# EAGLE design DACBRDV32 (EAGLE 5.07)
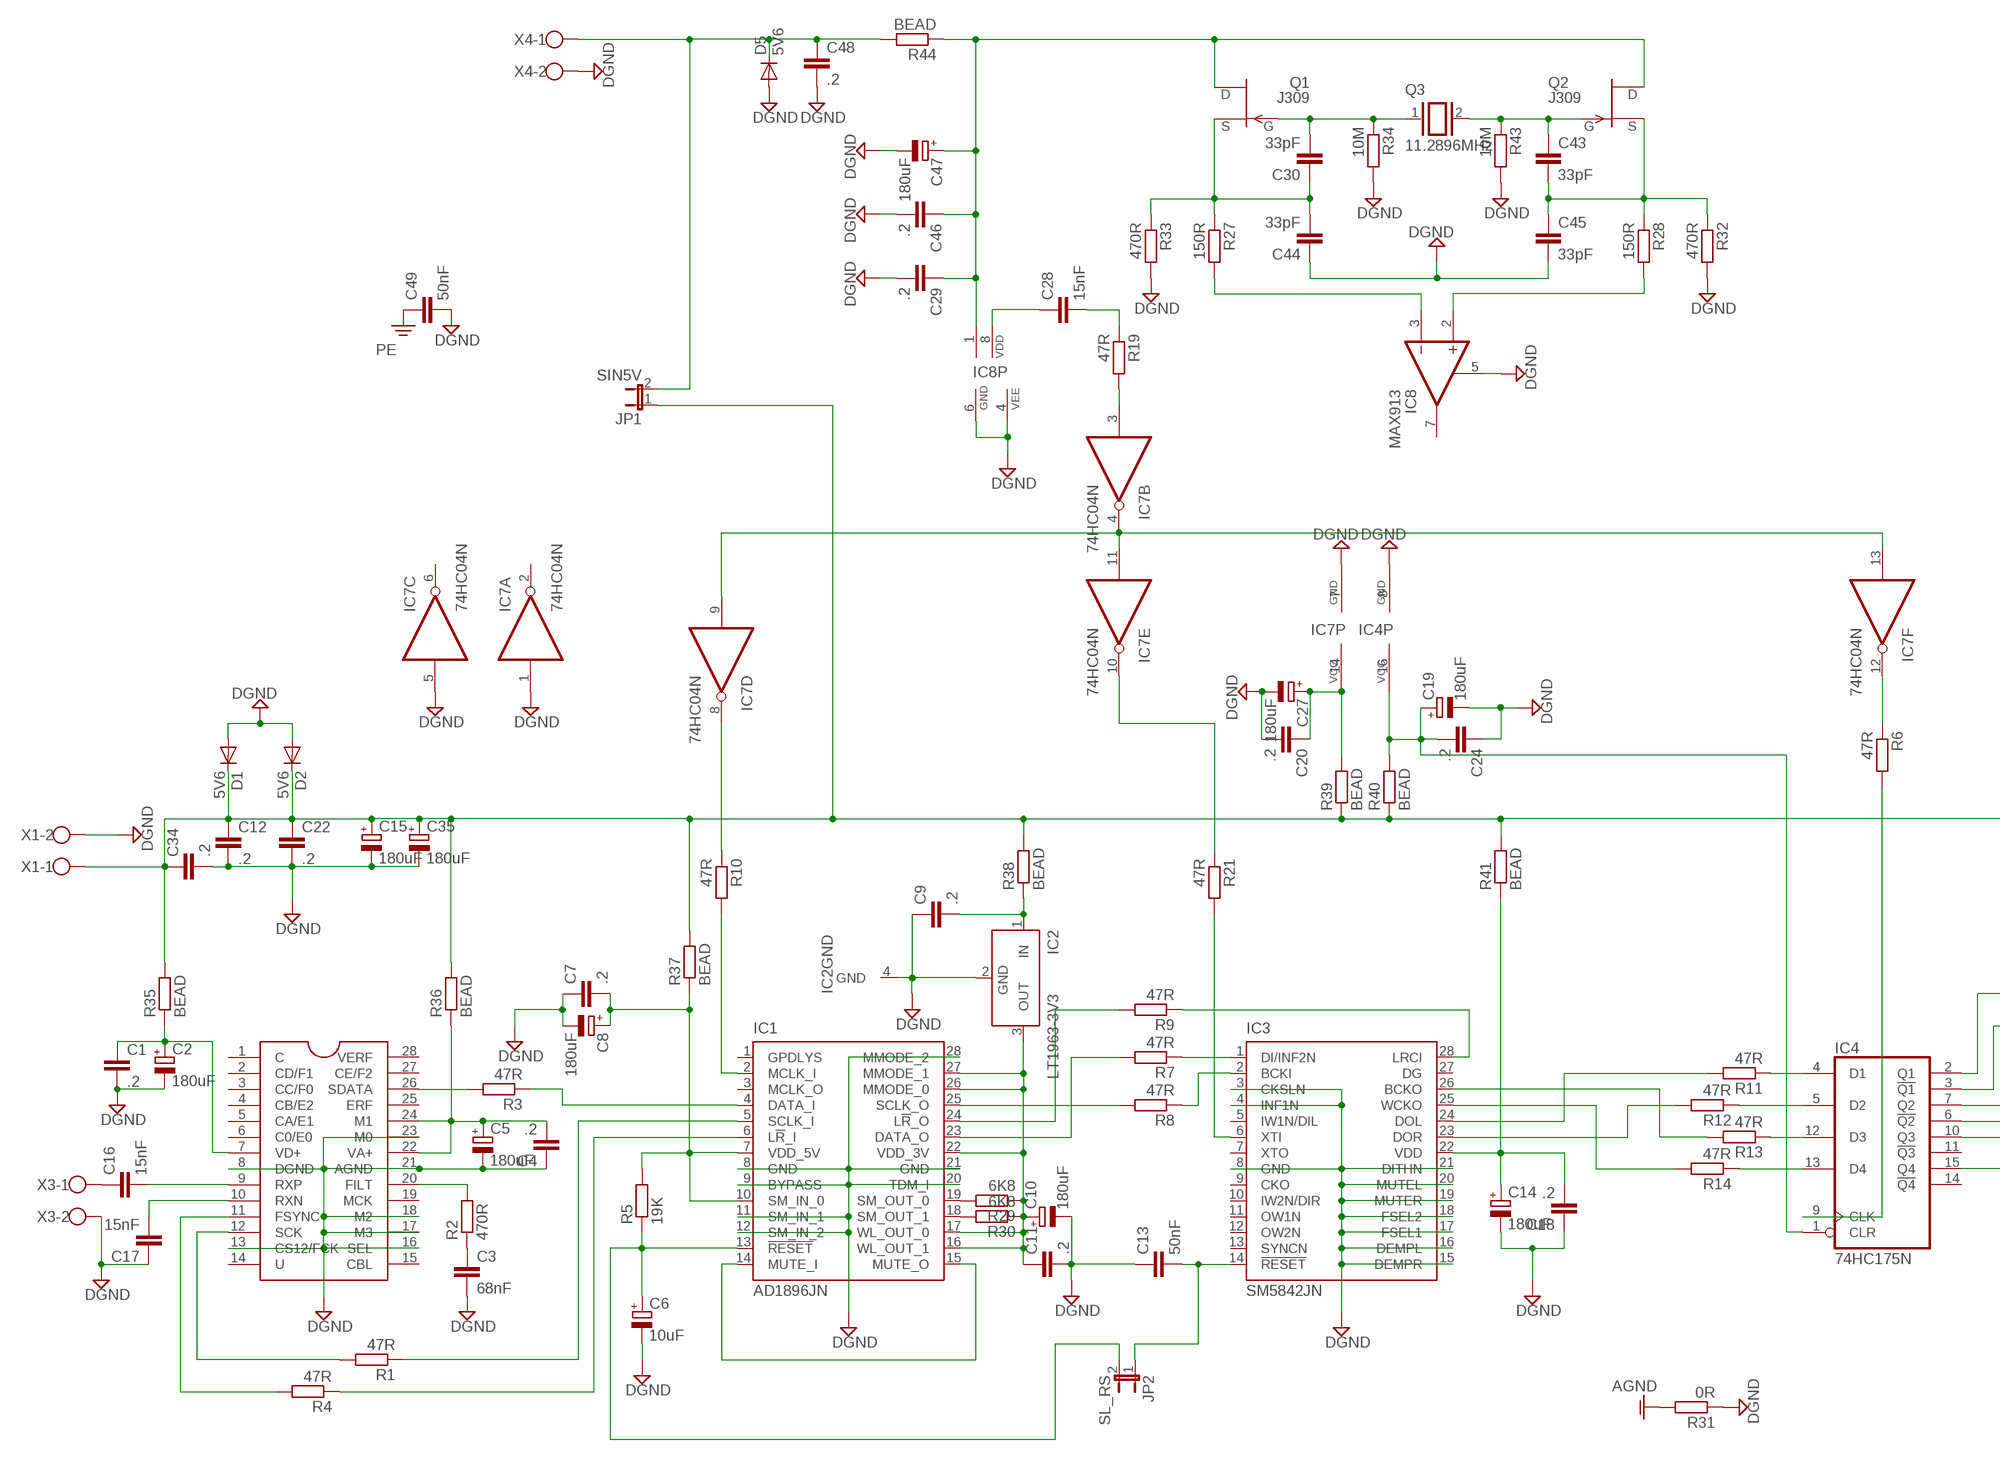
[diagram p0: schematic, sheet 1, part 1 of 2]
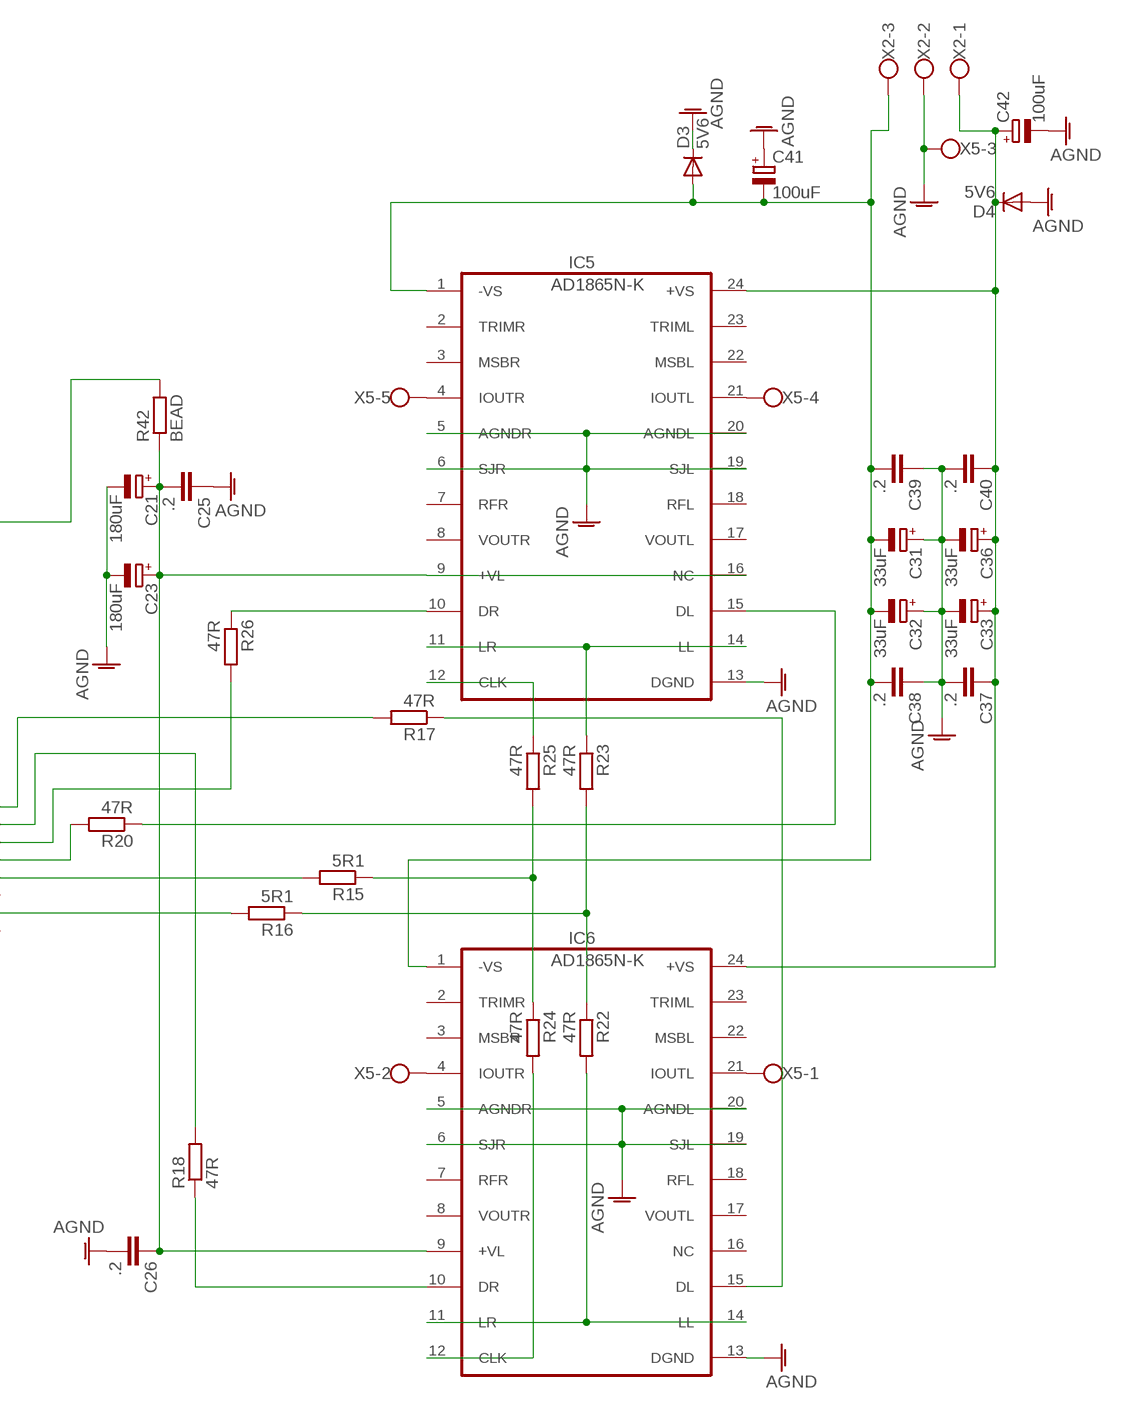
[diagram p1: schematic, sheet 1, part 2 of 2]

## Parts
C1  .2  C-EUC1210K  [C1210K]
C2  180uF  CPOL-EUE3.5-8  [E3,5-8]
C3  68nF  C-EU050-075X075  [C050-075X075]
C4  .2  C-EUC1210K  [C1210K]
C5  180uF  CPOL-EUE3.5-8  [E3,5-8]
C6  10uF  CPOL-EUE3.5-8  [E3,5-8]
C7  .2  C-EUC1210K  [C1210K]
C8  180uF  CPOL-EUE3.5-8  [E3,5-8]
C9  .2  C-EUC1210K  [C1210K]
C10  180uF  CPOL-EUE3.5-8  [E3,5-8]
C11  .2  C-EUC1210K  [C1210K]
C12  .2  C-EUC1210K  [C1210K]
C13  50nF  C-EU050-035X075  [C050-035X075]
C14  180uF  CPOL-EUE3.5-8  [E3,5-8]
C15  180uF  CPOL-EUE3.5-8  [E3,5-8]
C16  15nF  C-EU050-055X075  [C050-055X075]
C17  15nF  C-EU050-055X075  [C050-055X075]
C18  .2  C-EUC1210K  [C1210K]
C19  180uF  CPOL-EUE3.5-8  [E3,5-8]
C20  .2  C-EUC1210K  [C1210K]
C21  180uF  CPOL-EUE3.5-8  [E3,5-8]
C22  .2  C-EUC1210K  [C1210K]
C23  180uF  CPOL-EUE3.5-8  [E3,5-8]
C24  .2  C-EUC1210K  [C1210K]
C25  .2  C-EUC1210K  [C1210K]
C26  .2  C-EUC1210K  [C1210K]
C27  180uF  CPOL-EUE3.5-8  [E3,5-8]
C28  15nF  C-EU050-055X075  [C050-055X075]
C29  .2  C-EUC1210K  [C1210K]
C30  33pF  C-EU050-030X075  [C050-030X075]
C31  33uF  CPOL-EUE3.5-8  [E3,5-8]
C32  33uF  CPOL-EUE3.5-8  [E3,5-8]
C33  33uF  CPOL-EUE3.5-8  [E3,5-8]
C34  .2  C-EUC1210K  [C1210K]
C35  180uF  CPOL-EUE3.5-8  [E3,5-8]
C36  33uF  CPOL-EUE3.5-8  [E3,5-8]
C37  .2  C-EUC1210K  [C1210K]
C38  .2  C-EUC1210K  [C1210K]
C39  .2  C-EUC1210K  [C1210K]
C40  .2  C-EUC1210K  [C1210K]
C41  100uF  CPOL-EUE5-10.5  [E5-10,5]
C42  100uF  CPOL-EUE5-10.5  [E5-10,5]
C43  33pF  C-EU050-030X075  [C050-030X075]
C44  33pF  C-EU050-030X075  [C050-030X075]
C45  33pF  C-EU050-030X075  [C050-030X075]
C46  .2  C-EUC1210K  [C1210K]
C47  180uF  CPOL-EUE3.5-8  [E3,5-8]
C48  .2  C-EUC1210K  [C1210K]
C49  50nF  C-EU050-035X075  [C050-035X075]
D1  5V6  A114  [DO204-10]
D2  5V6  A114  [DO204-10]
D3  5V6  A114  [DO204-10]
D4  5V6  A114  [DO204-10]
D5  5V6  A114  [DO204-10]
IC1  AD1896JN  [DIL28-6]
IC2  LT1963-3V3  LT1129CST5  [SOT223]
IC3  SM5842JN  [DIL28-6]
IC4  74HC175N  74175N  [DIL16]
IC5  AD1865N-K  AD1865  [DIL24-6]
IC6  AD1865N-K  AD1865  [DIL24-6]
IC7  74HC04N  7404N  [DIL14]
IC8  MAX913  MAX903CPA  [DIL08]
JP1  SIN5V  JP1E  [JP1]
JP2  SL_RS  JP1E  [JP1]
Q1  J309  SST5484  [SOT23]
Q2  J309  SST5484  [SOT23]
Q3  11.2896MHz  XTAL/S  [QS]
R1  47R  R-EU_0207/12  [0207/12]
R2  470R  R-EU_0204/7  [0204/7]
R3  47R  R-EU_0207/10  [0207/10]
R4  47R  R-EU_0207/12  [0207/12]
R5  19K  R-EU_0204/7  [0204/7]
R6  47R  R-EU_0207/10  [0207/10]
R7  47R  R-EU_0204/7  [0204/7]
R8  47R  R-EU_0207/10  [0207/10]
R9  47R  R-EU_0207/15  [0207/15]
R10  47R  R-EU_0204/7  [0204/7]
R11  47R  R-EU_0204/7  [0204/7]
R12  47R  R-EU_0207/10  [0207/10]
R13  47R  R-EU_0204/7  [0204/7]
R14  47R  R-EU_0204/7  [0204/7]
R15  5R1  R-EU_0204/7  [0204/7]
R16  5R1  R-EU_0204/7  [0204/7]
R17  47R  R-EU_0207/10  [0207/10]
R18  47R  R-EU_0207/10  [0207/10]
R19  47R  R-EU_0204/7  [0204/7]
R20  47R  R-EU_0204/7  [0204/7]
R21  47R  R-EU_0204/7  [0204/7]
R22  47R  R-EU_0207/12  [0207/12]
R23  47R  R-EU_0207/15  [0207/15]
R24  47R  R-EU_0207/12  [0207/12]
R25  47R  R-EU_0207/15  [0207/15]
R26  47R  R-EU_0207/12  [0207/12]
R27  150R  R-EU_0204/7  [0204/7]
R28  150R  R-EU_0204/7  [0204/7]
R29  6K8  R-EU_M1206  [M1206]
R30  6K8  R-EU_M1206  [M1206]
R31  0R  R-EU_0204/7  [0204/7]
R32  470R  R-EU_0204/7  [0204/7]
R33  470R  R-EU_0204/7  [0204/7]
R34  10M  R-EU_0204/7  [0204/7]
R35  BEAD  R-EU_R1210  [R1210]
R36  BEAD  R-EU_R1210  [R1210]
R37  BEAD  R-EU_R1210  [R1210]
R38  BEAD  R-EU_R1210  [R1210]
R39  BEAD  R-EU_R1210  [R1210]
R40  BEAD  R-EU_R1210  [R1210]
R41  BEAD  R-EU_R1210  [R1210]
R42  BEAD  R-EU_R1210  [R1210]
R43  10M  R-EU_0204/7  [0204/7]
R44  BEAD  R-EU_R1210  [R1210]
U$1  CS8414  CS8414DIP  [DIL28]
X1  W237-02P  [W237-132]
X2  W237-03P  [W237-133]
X3  W237-02P  [W237-132]
X4  W237-02P  [W237-132]
X5  W237-05P  [W237-5P]

## Nets
AGND: C21.- C23.- C25.1 C26.2 C31.+ C32.+ C33.- C36.- C37.2 C38.1 C39.1 C40.2 C41.+ C42.- D3.C D4.A IC5.5(AGNDR) IC5.6(SJR) IC5.13(DGND) IC5.19(SJL) IC5.20(AGNDL) IC6.5(AGNDR) IC6.6(SJR) IC6.13(DGND) IC6.19(SJL) IC6.20(AGNDL) R31.2 X2.2 X5.3
DGND: C1.2 C2.- C3.2 C4.1 C5.- C6.- C7.1 C8.- C9.1 C10.- C11.2 C12.2 C13.1 C14.- C15.- C17.1 C18.1 C19.- C20.2 C22.2 C24.1 C27.- C29.2 C34.2 C35.- C44.1 C45.2 C46.2 C47.- C48.2 C49.2 D1.A D2.A D5.A IC1.8(GND) IC1.9(BYPASS) IC1.11(SM_IN_1) IC1.12(SM_IN_2) IC1.20(TDM_I) IC1.21(GND) IC1.28(MMODE_2) IC2.2(GND) IC2.4(GND) IC3.3(CKSLN) IC3.4(INF1N) IC3.8(GND) IC3.15(DEMPR) IC3.16(DEMPL) IC3.17(FSEL1) IC3.18(FSEL2) IC3.19(MUTER) IC3.20(MUTEL) IC3.21(DITHN) IC4.8(GND) IC7.1(A:I) IC7.5(C:I) IC7.7(P:GND) IC8.4(VEE) IC8.5(LATCH) IC8.6(GND) R31.1 R32.2 R33.2 R34.2 R43.2 U$1.8(DGND) U$1.13(CS12/FCK) U$1.16(SEL) U$1.17(M3) U$1.18(M2) U$1.21(AGND) U$1.23(M0) X1.2 X3.2 X4.2
N$1: R2.2 U$1.20(FILT)
N$2: IC1.14(MUTE_I) IC1.15(MUTE_O)
N$3: C3.1 R2.1
N$5: IC1.4(DATA_I) R3.1
N$6: IC1.5(SCLK_I) R1.1
N$7: IC1.6(L!R!_I) R4.1
N$8: C10.+ C11.1 IC1.16(WL_OUT_1) IC1.17(WL_OUT_0) IC1.22(VDD_3V) IC1.26(MMODE_0) IC1.27(MMODE_1) IC2.3(OUT) R29.1 R30.1
N$9: C7.2 C8.+ IC1.7(VDD_5V) IC1.10(SM_IN_0) R5.2 R37.1
N$10: C6.+ IC1.13(!RESET) JP2.2 R5.1
N$11: C9.2 IC2.1(IN) R38.1
N$12: IC1.2(MCLK_I) R10.2
N$14: IC7.8(D:O) R10.1
N$15: IC7.12(F:O) R6.1
N$16: C20.1 C27.+ IC7.14(P:VCC) R39.2
N$17: IC3.6(XTI) R21.2
N$18: IC3.1(DI/INF2N) R7.1
N$19: R3.2 U$1.26(SDATA)
N$20: IC3.2(BCKI) R8.1
N$21: IC1.23(DATA_O) R7.2
N$22: IC1.25(SCLK_O) R8.2
N$23: C17.2 U$1.10(RXN)
N$24: C16.2 U$1.9(RXP)
N$25: C16.1 X3.1
N$26: IC1.24(L!R!_O) R9.2
N$27: IC3.28(LRCI) R9.1
N$28: IC7.10(E:O) R21.1
N$29: C13.2 IC3.14(!RESET) JP2.1
N$30: C14.+ C18.2 IC3.22(VDD) R41.1
N$31: IC3.26(BCKO) R13.2
N$32: C4.2 C5.+ R36.1 U$1.22(VA+) U$1.24(M1)
N$33: R4.2 U$1.11(FSYNC)
N$34: R1.2 U$1.12(SCK)
N$35: C19.+ C24.2 IC4.1(CLR) IC4.16(VCC) R40.2
N$36: IC3.24(DOL) R11.2
N$37: IC3.23(DOR) R12.2
N$38: IC4.4(D1) R11.1
N$39: C1.1 C2.+ R35.1 U$1.7(VD+)
N$40: IC4.5(D2) R12.1
N$41: IC4.12(D3) R13.1
N$44: IC4.13(D4) R14.1
N$45: IC3.25(WCKO) R14.2
N$47: IC4.10(Q3) R15.2
N$48: IC4.15(Q4) R16.2
N$49: IC4.2(Q1) R17.2
N$50: IC4.3(!Q1) R18.2
N$51: IC5.10(DR) R26.1
N$52: IC4.6(!Q2) R20.2
N$53: IC4.9(CLK) R6.2
N$55: IC6.11(LR) IC6.14(LL) R22.2
N$57: R16.1 R22.1 R23.2
N$58: R15.1 R24.1 R25.2
N$59: IC5.12(CLK) R25.1
N$60: IC6.12(CLK) R24.2
N$61: IC7.4(B:O) IC7.9(D:I) IC7.11(E:I) IC7.13(F:I)
N$62: C21.+ C23.+ C25.2 C26.1 IC5.9(+VL) IC5.16(NC) IC6.9(+VL) R42.1
N$63: IC5.15(DL) R20.1
N$64: IC6.10(DR) R18.1
N$65: IC4.7(Q2) R26.2
N$66: IC6.15(DL) R17.1
N$68: IC7.3(B:I) R19.2
N$69: C28.1 IC8.8(VDD)
N$71: IC5.11(LR) IC5.14(LL) R23.1
N$72: C28.2 R19.1
N$73: C30.1 C44.2 Q1.2(S) R27.1 R33.1
N$74: C31.- C32.- C38.2 C39.2 C41.- D3.A IC5.1(-VS) IC6.1(-VS) X2.3
N$75: IC8.3(-IN) R27.2
N$76: IC5.4(IOUTR) X5.5
N$77: C33.+ C36.+ C37.1 C40.1 C42.+ D4.C IC5.24(+VS) IC6.24(+VS) X2.1
N$78: IC5.21(IOUTL) X5.4
N$79: IC6.21(IOUTL) X5.1
N$80: IC6.4(IOUTR) X5.2
N$81: IC8.2(+IN) R28.2
N$82: C12.1 C15.+ C22.1 C34.1 C35.+ D1.C D2.C JP1.1 R35.2 R36.2 R37.2 R38.2 R39.1 R40.1 R41.2 R42.2 X1.1
N$83: C29.1 C46.1 C47.+ IC8.1(VCC) Q1.1(D) Q2.1(D) R44.1
N$84: IC1.19(SM_OUT_0) R29.2
N$85: IC1.18(SM_OUT_1) R30.2
N$86: C43.2 C45.1 Q2.2(S) R28.1 R32.1
N$87: C30.2 Q1.3(G) Q3.1 R34.1
N$88: C43.1 Q2.3(G) Q3.2 R43.1
N$90: C48.1 D5.C JP1.2 R44.2 X4.1
PE: C49.1
Unconnected: IC1.1(GPDLYS) IC1.3(MCLK_O) IC3.5(IW1N/DIL) IC3.7(XTO) IC3.9(CKO) IC3.10(IW2N/DIR) IC3.11(OW1N) IC3.12(OW2N) IC3.13(SYNCN) IC3.27(DG) IC4.11(!Q3) IC4.14(!Q4) IC5.2(TRIMR) IC5.3(MSBR) IC5.7(RFR) IC5.8(VOUTR) IC5.17(VOUTL) IC5.18(RFL) IC5.22(MSBL) IC5.23(TRIML) IC6.2(TRIMR) IC6.3(MSBR) IC6.7(RFR) IC6.8(VOUTR) IC6.16(NC) IC6.17(VOUTL) IC6.18(RFL) IC6.22(MSBL) IC6.23(TRIML) IC7.2(A:O) IC7.6(C:O) IC8.7(OUT) U$1.1(C) U$1.2(CD/F1) U$1.3(CC/F0) U$1.4(CB/E2) U$1.5(CA/E1) U$1.6(C0/E0) U$1.14(U) U$1.15(CBL) U$1.19(MCK) U$1.25(ERF) U$1.27(CE/F2) U$1.28(VERF)

## Library data of the parts
C1 C3 C4 C7 C9 C11-C13 C16-C18 C20 C22 C24-C26 C28-C30 C34 C37-C40 C43-C46 C48 C49 = resistor:C-EU: CAPACITOR, European symbol
C2 C5 C6 C8 C10 C14 C15 C19 C21 C23 C27 C31-C33 C35 C36 C41 C42 C47 = resistor:CPOL-EU: POLARIZED CAPACITOR, European symbol
D1-D5 = diode:A114: DIODE germanium
IC1 = analog-devices:AD1896: Stereo Asynchronous Sample Rate Converter Auto generated by make-symbol-device-package-bsdl.ulp Rev. 33 Source: http://www.analog.com/static/imported-files/data_sheets/AD1896.pdf
IC2 = linear-technology:LT1129CST5: VOLTAGE REGULATOR with shutdown
IC3 = analog-devices:SM5842: High-Class Audio Multi-function Digital Filter Source: http://www.dddac.de/files/SM5842.pdf
IC4 = 74xx-us:74*175: Qadruple D type FLIP FLOP, clear
IC5 IC6 = pavouk:AD1865: Complete Dual 18-Bit 16xFS Audio DAC
IC7 = 74xx-us:74*04: Hex INVERTER
IC8 = maxim:MAX903CPA: VOLTAGE COMPARATOR
JP1 JP2 = jumper:JP1E: JUMPER
Q1 Q2 = transistor-fet:?548*: N-Channel JFETs Source: VISHAY 2N5484.pdf Compatible: TO92 2N5245 J304 J305 U310 J308 J309 J310 TO72 2N4416 2N4416A 2N3823 2N4351 3N169 3N170 3N171 MFE3002 TO18 2N3796 2N3797 MFE825 Source: Motorola European Master Guide Pacge 3-59
Q3 = special:XTAL/S: CRYSTAL
R1-R44 = resistor:R-EU_: RESISTOR, European symbol
U$1 = cirrus-dar:CS8414: 24bit 96kHz Digital Audio Receiver
X1 X3 X4 = con-wago-508:W237-02P: WAGO SREW CLAMP
X2 = con-wago-508:W237-03P: WAGO SREW CLAMP
X5 = con-wago-508:W237-05P: WAGO SREW CLAMP

## Board
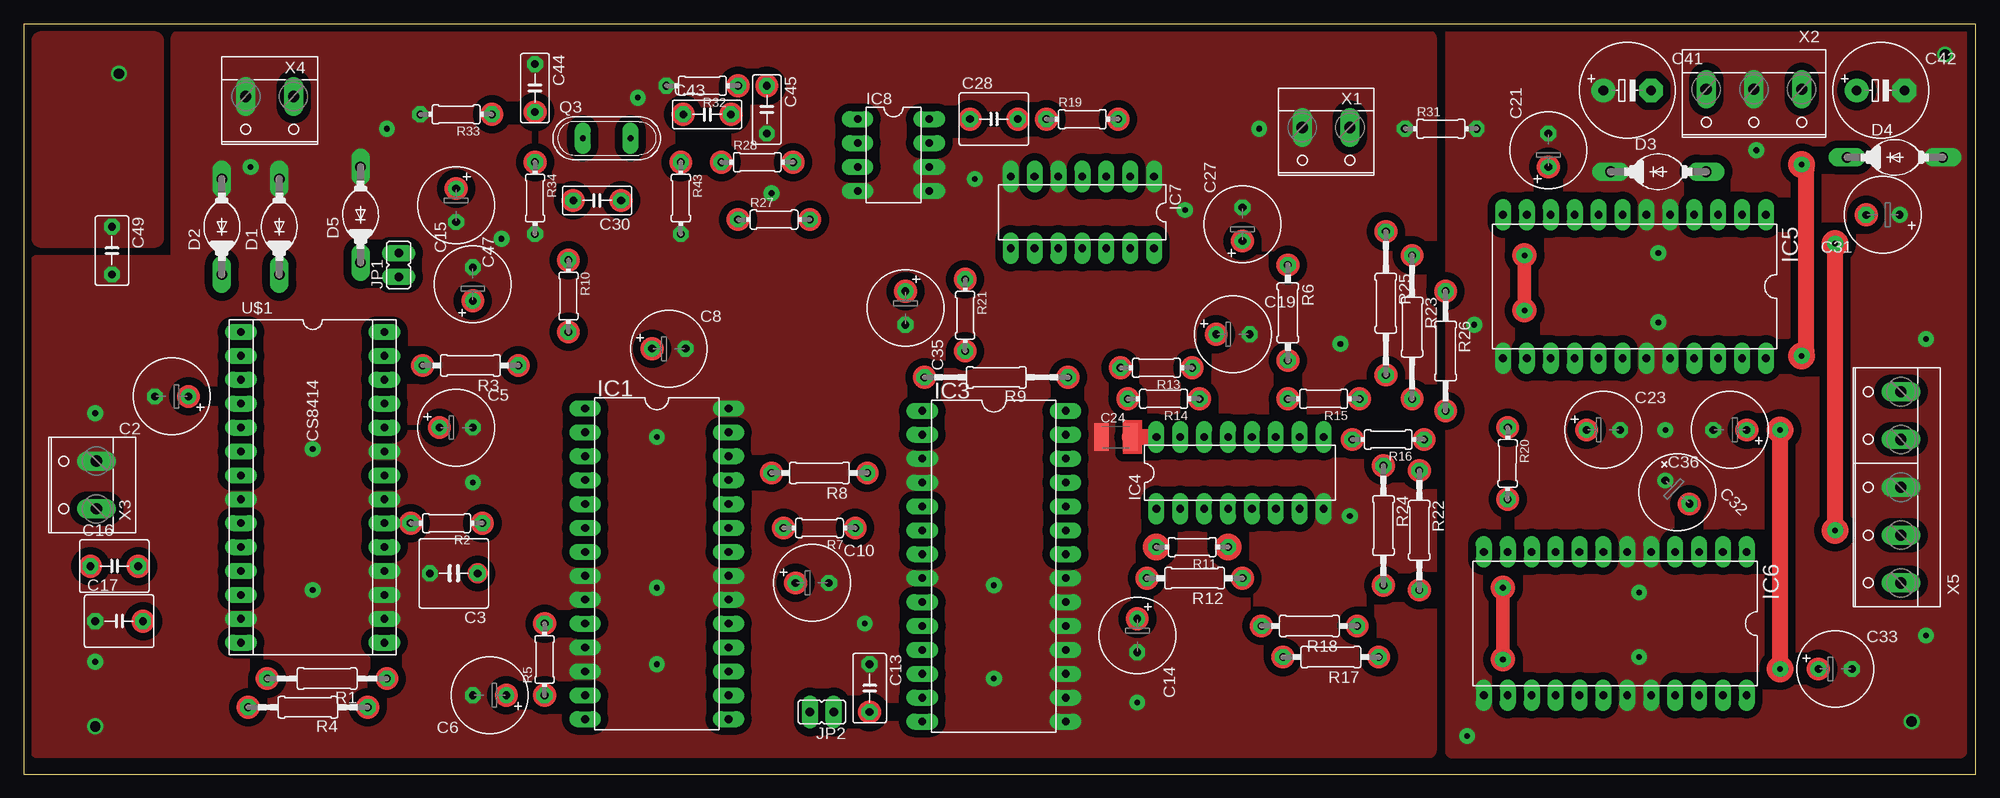
[diagram p2: board, top side]
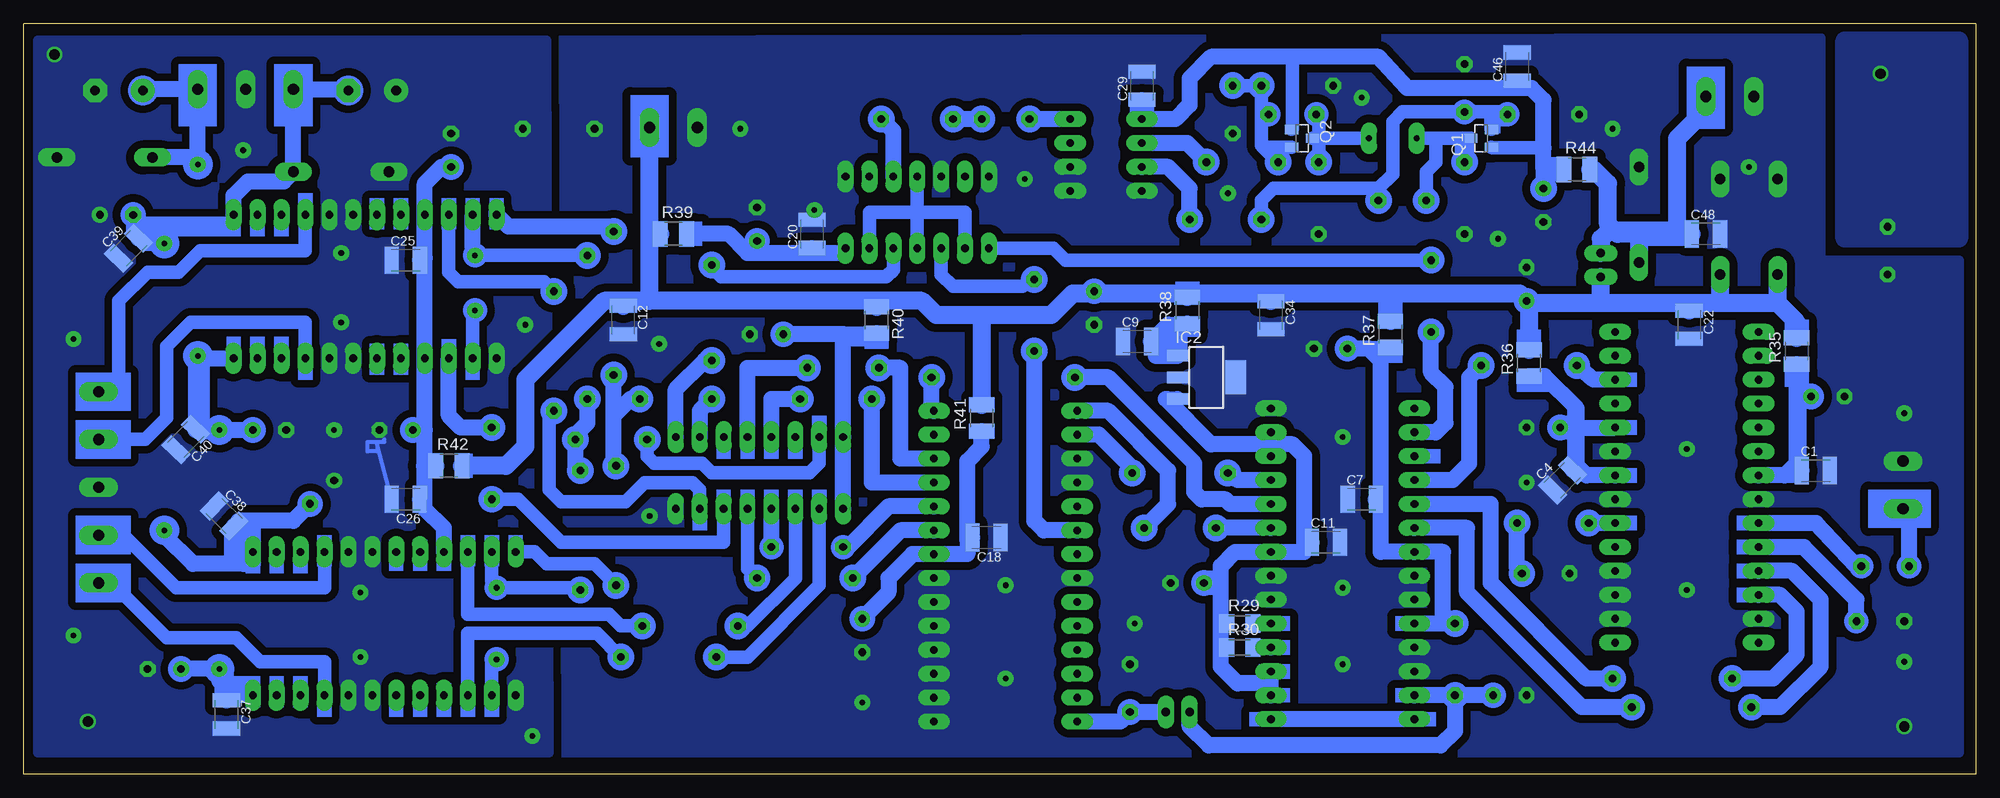
[diagram p3: board, bottom side, seen from below]

Size 207.5 x 79.76 mm. Coordinates in mm from the lower left corner, seen from the top.
Outline: 207.5,79.76 207.5,0 0,0 0,79.76 207.5,79.76
Copper layers (1*16): Top 0.035mm / dielectric 1.5mm / Bottom 0.035mm
Design rules "default *": minimum track width 10mil, minimum drill 24mil, track to track 8mil, track to pad 8mil, pad to pad 8mil, via to via 8mil, smd to smd 8mil, copper to edge 30mil, drill to drill 8mil, minimum pad ring 17mil, minimum via ring 8mil, stop-mask expansion 4mil, vias tented up to drill 0mil, thermal gap 10mil

### Footprints (pad centres in the part's own frame; a part is rotated, then mirrored left to right if it is on the bottom)
C1210K = smd 1.5 x 2.9: 1 -1.5,0; 2 1.5,0
E3,5-8 = drill 0.813 pad 1.6 round: + -1.778,0 | drill 0.813 pad 1.6 octagon: - 1.778,0
C050-075X075 = drill 0.813 octagon: 1 -2.54,0; 2 2.54,0
C050-035X075 = drill 0.813 octagon: 1 -2.54,0; 2 2.54,0
C050-055X075 = drill 0.813 octagon: 1 -2.54,0; 2 2.54,0
C050-030X075 = drill 0.813 octagon: 1 -2.54,0; 2 2.54,0
E5-10,5 = drill 1.016 pad 2.54 round: + -2.54,0 | drill 1.016 pad 2.54 octagon: - 2.54,0
DO204-10 = drill 1.118 long: A 5.08,0; C -5.08,0
DIL28-6 = drill 0.813 pad 1.676 long: 1 -16.51,-7.62; 2 -13.97,-7.62; 3 -11.43,-7.62; 4 -8.89,-7.62; 5 -6.35,-7.62; 6 -3.81,-7.62; 7 -1.27,-7.62; 8 1.27,-7.62; 9 3.81,-7.62; 10 6.35,-7.62; 11 8.89,-7.62; 12 11.43,-7.62; 13 13.97,-7.62; 14 16.51,-7.62; 15 16.51,7.62; 16 13.97,7.62; 17 11.43,7.62; 18 8.89,7.62; 19 6.35,7.62; 20 3.81,7.62; 21 1.27,7.62; 22 -1.27,7.62; 23 -3.81,7.62; 24 -6.35,7.62; 25 -8.89,7.62; 26 -11.43,7.62; 27 -13.97,7.62; 28 -16.51,7.62
SOT223 = smd 1.219 x 2.235: 1 -2.311,-3.099; 2 0,-3.099; 3 2.311,-3.099 | smd 3.6 x 2.2: 4 0,3.099
DIL16 = drill 0.813 pad 1.676 long: 1 -8.89,-3.81; 2 -6.35,-3.81; 3 -3.81,-3.81; 4 -1.27,-3.81; 5 1.27,-3.81; 6 3.81,-3.81; 7 6.35,-3.81; 8 8.89,-3.81; 9 8.89,3.81; 10 6.35,3.81; 12 1.27,3.81; 13 -1.27,3.81; 14 -3.81,3.81; 15 -6.35,3.81; 16 -8.89,3.81 | drill 0.8 pad 1.676 long: 11 3.81,3.81
DIL24-6 = drill 0.813 long: 1 -13.97,-7.62; 2 -11.43,-7.62; 3 -8.89,-7.62; 4 -6.35,-7.62; 5 -3.81,-7.62; 6 -1.27,-7.62; 7 1.27,-7.62; 8 3.81,-7.62; 9 6.35,-7.62; 10 8.89,-7.62; 11 11.43,-7.62; 12 13.97,-7.62; 13 13.97,7.62; 14 11.43,7.62; 15 8.89,7.62; 16 6.35,7.62; 17 3.81,7.62; 18 1.27,7.62; 19 -1.27,7.62; 20 -3.81,7.62; 21 -6.35,7.62; 22 -8.89,7.62; 23 -11.43,7.62; 24 -13.97,7.62
DIL14 = drill 0.813 pad 1.676 long: 1 -7.62,-3.81; 2 -5.08,-3.81; 3 -2.54,-3.81; 4 0,-3.81; 5 2.54,-3.81; 6 5.08,-3.81; 7 7.62,-3.81; 8 7.62,3.81; 9 5.08,3.81; 10 2.54,3.81; 11 0,3.81; 12 -2.54,3.81; 13 -5.08,3.81; 14 -7.62,3.81
DIL08 = drill 0.813 long: 1 -3.81,-3.81; 2 -1.27,-3.81; 3 1.27,-3.81; 4 3.81,-3.81; 5 3.81,3.81; 6 1.27,3.81; 7 -1.27,3.81; 8 -3.81,3.81
JP1 = drill 0.914 long: 1 0,-1.27; 2 0,1.27
SOT23 = smd 1 x 1.4: 1 -0.95,-1.1; 2 0.95,-1.1; 3 0,1.1
QS = drill 0.61 pad 1.676 long: 1 -2.54,0; 2 2.54,0
0207/12 = drill 0.813 octagon: 1 -6.35,0; 2 6.35,0
0204/7 = drill 0.813 octagon: 1 -3.81,0; 2 3.81,0
0207/10 = drill 0.813 octagon: 1 -5.08,0; 2 5.08,0
0207/15 = drill 0.813 octagon: 1 -7.62,0; 2 7.62,0
M1206 = smd 1.6 x 2: 1 -1.4,0; 2 1.4,0
R1210 = smd 1.6 x 2.7: 1 -1.4,0; 2 1.4,0
DIL28 = drill 0.813 pad 1.676 long: 1 -16.51,-7.62; 2 -13.97,-7.62; 3 -11.43,-7.62; 4 -8.89,-7.62; 5 -6.35,-7.62; 6 -3.81,-7.62; 7 -1.27,-7.62; 8 1.27,-7.62; 9 3.81,-7.62; 10 6.35,-7.62; 11 8.89,-7.62; 12 11.43,-7.62; 13 13.97,-7.62; 14 16.51,-7.62; 15 16.51,7.62; 16 13.97,7.62; 17 11.43,7.62; 18 8.89,7.62; 19 6.35,7.62; 20 3.81,7.62; 22 -1.27,7.62; 23 -3.81,7.62; 24 -6.35,7.62; 25 -8.89,7.62; 26 -11.43,7.62; 27 -13.97,7.62; 28 -16.51,7.62 | drill 0.813 pad 1.6 long: 21 1.27,7.62
W237-132 = drill 1.194 long: 1 -2.54,-0.635; 2 2.54,-0.635
W237-133 = drill 1.194 long: 1 -5.08,-0.635; 2 0,-0.635; 3 5.08,-0.635
W237-5P = drill 1.194 long: 1 -10.16,-0.635; 2 -5.08,-0.635; 3 0,-0.635; 4 5.08,-0.635; 5 10.16,-0.635

### Placement (x,y rotation side)
C1  17.02,32.26 0 bottom
C2  15.75,40.13 180 top
C3  45.72,21.34 180 top
C4  43.94,31.24 44.9 bottom
C5  45.97,36.83 0 top
C6  49.53,8.38 180 top
C7  65.28,29.21 0 bottom
C8  68.58,45.21 0 top
C9  89.15,45.97 0 bottom
C10  83.82,20.32 0 top
C11  69.09,24.64 0 bottom
C12  143.76,48.26 270 bottom
C13  89.92,9.14 270 top
C14  118.36,14.73 270 top
C15  47.75,52.07 90 top
C16  9.65,22.1 0 top
C17  10.16,16.26 0 top
C18  105.16,25.15 180 bottom
C19  128.52,46.74 0 top
C20  123.7,57.4 90 bottom
C21  162.05,66.29 90 top
C22  30.48,47.75 270 bottom
C23  167.89,36.58 0 top
C24  116.08,35.81 0 top
C25  166.88,54.61 0 bottom
C26  166.88,29.21 179.9 bottom
C27  129.54,58.42 90 top
C28  103.12,69.6 0 top
C29  88.65,73.15 90 bottom
C30  60.96,60.96 180 top
C31  197.61,59.44 180.2 top
C32  175.77,29.97 316.1 top
C33  192.53,11.18 0 top
C34  74.93,48.77 270 bottom
C35  93.73,49.53 270 top
C36  181.36,36.58 180 top
C37  185.93,6.35 270 bottom
C38  186.18,27.43 315 bottom
C39  196.34,55.88 44.9 bottom
C40  190.25,35.56 226 bottom
C41  170.43,72.64 0 top
C42  197.36,72.64 0 top
C43  72.64,70.1 0 top
C44  54.36,72.9 270 top
C45  78.99,70.61 270 top
C46  48.77,75.18 90 bottom
C47  45.97,60.45 270 top
C48  28.7,57.4 0 bottom
C49  9.4,55.63 270 top
D1  27.18,58.17 90 top
D2  21.08,58.17 90 top
D3  173.74,64.01 0 top
D4  198.88,65.53 0 top
D5  35.81,59.44 90 top
IC1  67.31,22.35 270 top
IC2  81.79,42.16 270 bottom
IC3  103.12,22.1 270 top
IC4  129.29,32 0 top
IC5  171.2,51.82 180 top
IC6  169.16,16 180 top
IC7  112.52,59.69 180 top
IC8  92.46,65.79 270 top
JP1  39.88,54.1 0 top
JP2  84.84,6.6 90 top
Q1  52.58,67.56 90 bottom
Q2  71.63,67.56 270 bottom
Q3  61.98,67.56 0 top
R1  32.26,10.16 180 top
R2  44.96,26.67 180 top
R3  47.5,43.43 180 top
R4  30.23,7.11 180 top
R5  55.37,12.19 90 top
R6  134.37,49.02 270 top
R7  84.58,26.16 180 top
R8  84.58,32 180 top
R9  103.38,42.16 180 top
R10  57.91,50.8 270 top
R11  124.21,24.13 180 top
R12  124.46,20.83 180 top
R13  120.4,43.18 180 top
R14  121.16,39.88 180 top
R15  138.18,39.88 180 top
R16  145.03,35.56 180 top
R17  138.94,12.45 180 top
R18  136.65,15.75 180 top
R19  112.52,69.6 0 top
R20  157.73,33.02 269.8 top
R21  100.08,48.77 270 top
R22  148.34,25.91 270 top
R23  147.57,47.5 270 top
R24  144.53,26.42 270 top
R25  144.78,50.04 270 top
R26  151.13,44.96 270 top
R27  79.76,58.93 0 top
R28  77.98,65.02 0 top
R29  78.23,16 0 bottom
R30  78.23,13.46 0 bottom
R31  150.62,68.58 0 top
R32  72.14,73.15 180 top
R33  45.97,70.1 180 top
R34  54.36,61.21 270 top
R35  19.05,44.96 90 bottom
R36  47.5,43.69 90 bottom
R37  62.23,46.74 90 bottom
R38  83.82,49.28 90 bottom
R39  138.43,57.4 0 bottom
R40  116.84,48.26 270 bottom
R41  105.66,37.85 90 bottom
R42  162.31,32.77 0 bottom
R43  69.85,61.21 270 top
R44  42.42,64.26 0 bottom
U$1  30.73,30.48 270 top
X1  138.43,68.07 180 top
X2  183.9,72.14 180 top
X3  7.11,30.73 90 top
X4  26.16,71.37 180 top
X5  198.88,30.48 90 top

### Tracks (layer width: path | path; a pad name or v marks a point on that pad's centre or on a via)
AGND  (via drill 0.6 pad 1.68, 1.1 pad 1.68)
  Bottom 0.406: C26.2 169.93,35.06 169.93,34.29 170.94,34.29 170.94,35.31 169.16,35.31 169.16,35.56
  other vias: 154.18,47.75 173.74,48.01 173.74,55.37 171.7,19.3 171.7,12.45 174.5,36.58 202.18,46.23 153.42,4.06 184.15,66.29 202.18,14.73 200.66,5.59 204.22,76.45
  pour Bottom (isolate 0.813, no thermals): 205.99,77.98 151.89,77.98 151.64,2.29 205.99,2.29
  pour Top (isolate 0.813, no thermals): 151.89,78.49 151.89,2.54 205.74,2.54 205.74,78.49
DGND  (via drill 0.6 pad 1.68, 1.1 pad 1.68)
  other vias: 140.97,27.43 139.95,45.72 47.75,30.99 67.31,35.81 67.31,19.81 67.31,11.68 103.12,20.07 103.12,10.16 118.36,7.62 89.41,16 30.73,19.56 30.73,34.54 123.44,59.94 101.09,63.25 7.62,38.35 7.62,11.94 50.8,56.9 131.32,68.58 79.5,61.72 65.28,71.88 38.61,68.58 24.13,64.52 7.62,5.08
  pour Bottom (isolate 0.838, rank 5, no thermals): 1.78,54.61 1.78,2.29 157.73,2.29 157.99,77.98 16.51,78.23 16.51,54.61
  pour Top (isolate 0.813, no thermals): 1.52,54.36 16.51,54.36 16.51,78.23 149.35,78.23 149.35,2.54 1.52,2.54
N$1
  Bottom 1.676: U$1.20 R2.2
N$2
  Bottom 1.676: IC1.14 IC1.15
N$3
  Bottom 1.676: C3.1 48.77,21.84 R2.1
N$5
  Bottom 1.676: IC1.4 55.63,31.24 53.85,33.02 53.85,42.16 R3.1
N$6
  Bottom 1.676: R1.1 41.4,10.16 51.56,20.32 51.56,28.7 IC1.5
N$7
  Bottom 1.676: R4.1 41.91,7.11 54.1,19.3 54.1,26.16 IC1.6
N$8
  Bottom 1.676: 71.37,24.38 71.37,23.62 IC1.22 78.74,23.62 80.26,22.1 80.26,20.32 | 71.37,24.38 71.37,33.78 72.64,35.05 75.18,35.05 | 74.93,34.8 IC1.27 | 74.93,34.8 IC1.26 | 75.18,35.05 74.93,34.8 | 75.18,35.05 81.28,35.05 86.11,39.88 85.93,39.88 IC2.3 | C11.1 71.35,24.38 71.37,24.38 | IC1.16 74.93,9.65 | 74.93,9.65 IC1.17 | 74.93,9.65 78.49,9.65 80.26,11.43 80.26,13.72 | 80.26,13.72 80.26,16 | 80.26,16 80.26,20.32 | 80.26,16 R29.1 | R30.1 79.89,13.72 80.26,13.72 | 80.26,20.32 C10.+
N$9
  Bottom 1.676: R5.2 56.64,16 | 56.64,16 IC1.10 | 63.25,28.96 63.25,23.62 IC1.7 56.64,23.62 56.64,16 | C7.2 63.27,28.96 63.25,28.96 | 63.25,28.96 63.25,43.94 | 63.25,43.94 64.52,45.21 C8.+ | R37.1 62.35,45.21 62.48,45.21 63.25,44.45 63.25,43.94
N$10
  Bottom 1.676: R5.1 55.37,8.13 | R5.1 IC1.13 | R5.1 55.37,4.57 56.9,3.05 81.53,3.05 83.57,5.08 JP2.2 | C6.+ R5.1
N$11
  Bottom 1.676: R38.1 83.44,47.75 85.85,47.75 87.12,46.48 87.12,45.97
  Bottom 1.778: IC2.1 85.67,44.45 87.12,44.45 87.12,45.97 C9.2
N$12
  Bottom 1.676: IC1.2 57.4,36.32 56.39,37.34 56.39,41.15 57.91,42.67 R10.2
N$14
  Bottom 1.422: 57.66,54.61 R10.1 96.77,54.61 98.04,55.88 IC7.8
N$15
  Bottom 1.422: IC7.12 115.06,53.59 115.82,52.83 133.35,52.83 134.37,53.85 R6.1
N$16
  Bottom 1.676: IC7.14 120.65,55.37 123.7,55.37 | 123.7,55.37 129.54,55.37 | 129.54,55.37 130.56,55.37 132.59,57.4 R39.2 | 123.7,55.37 C20.1 | 129.54,55.37 C27.+
N$17
  Bottom 1.676: IC3.6 99.06,25.91 100.08,26.92 R21.2
N$18
  Bottom 1.676: R7.1 85.85,28.7 85.85,32.26 92.2,38.61 IC3.1
N$19
  Bottom 1.676: U$1.26 40.64,41.91 R3.2
N$20
  Bottom 1.676: IC3.2 93.22,36.07 89.66,32.51 R8.1
N$21
  Bottom 1.676: IC1.23 R7.2
N$22
  Bottom 1.676: IC1.25 78.49,31.24 R8.2
N$23
  Bottom 1.676: U$1.10 18.29,24.13 12.7,18.54 C17.2
N$24
  Bottom 1.676: U$1.9 17.02,26.67 12.7,22.1 C16.2
N$25
  Bottom 1.676: X3.1 7.11,28.32 C16.1
N$26
  Bottom 1.676: IC1.24 79.25,28.7 79.76,29.21 82.3,29.21 83.06,29.97 83.06,33.02 92.2,42.16 R9.2
N$27
  Bottom 1.676: IC3.28 111,38.86 R9.1
N$28
  Bottom 1.422: R21.1 101.35,51.82 108.71,51.82 109.98,53.09 IC7.10
N$29
  Bottom 1.676: IC3.14 90.93,5.59 C13.2 JP2.1
N$30
  Bottom 1.676: C14.+ 115.57,19.3 115.57,20.83 113.03,23.37 IC3.22 107.19,23.37 107.19,24.89 | R41.1 105.66,34.8 107.19,33.27 107.19,24.89 | C18.2 106.91,24.89 107.19,24.89
N$31
  Bottom 1.676: IC3.26 114.3,33.53 114.3,43.18 R13.2
N$32
  Bottom 1.676: 42.93,36.83 U$1.24 | 42.93,36.83 C5.+ | 42.42,37.08 42.42,32.77 42.29,32.64 | 42.42,37.08 42.42,38.86 45.84,42.29 R36.1 | 42.29,32.64 41.4,31.75 U$1.22 | 42.93,36.83 42.67,37.08 42.42,37.08 | C4.2 42.54,32.64 42.29,32.64
N$33
  Bottom 1.676: U$1.11 19.56,21.59 16.51,18.54 16.51,11.43 20.83,7.11 R4.2
N$34
  Bottom 1.676: U$1.12 20.83,19.05 19.05,17.27 19.05,12.7 21.59,10.16 R1.2
N$35
  Top 1.676: IC4.16 C24.2
  Bottom 1.676: IC4.1 IC4.16 120.4,46.76 | R40.2 116.94,46.76 120.4,46.76 | 120.4,46.76 120.42,46.74 C19.+
N$36
  Bottom 1.676: R11.2 119.89,24.13 115.57,28.45 IC3.24
N$37
  Bottom 1.676: IC3.23 114.3,25.91 R12.2
N$38
  Bottom 1.676: R11.1 IC4.4 128.02,28.96
N$39
  Bottom 1.676: U$1.7 20.32,31.75 20.07,32 | 20.07,32 19.05,33.02 19.05,40.13 | 19.05,40.13 C2.+ | C1.1 18.77,32 20.07,32 | 19.05,40.13 R35.1
N$40
  Bottom 1.422: IC4.5 130.56,21.84 R12.1
N$41
  Bottom 1.676: R13.1 130.56,43.18 IC4.12
N$44
  Bottom 1.676: R14.1 128.02,39.88 IC4.13
N$45
  Bottom 1.676: IC3.25 117.35,30.99 R14.2
N$47
  Bottom 1.676: R15.2 135.64,38.61 IC4.10
N$48
  Bottom 1.422: R16.2 141.22,33.78 140.46,33.02 135.38,33.02 134.37,32 123.95,32 122.94,33.02 IC4.15
N$49
  Bottom 1.422: IC4.2 122.94,20.07 130.56,12.45 R17.2
N$50
  Bottom 1.422: IC4.3 125.48,20.83 130.56,15.75 R18.2
N$51
  Bottom 1.422: R26.1 152.15,52.32 161.29,52.32 162.31,53.34 IC5.10
N$52
  Bottom 1.422: IC4.6 133.1,24.64 150.37,24.64 154.94,29.21 R20.2
N$53
  Bottom 1.676: IC4.9 138.18,40.89 135.13,43.94 R6.2
N$55  (via drill 0.6 pad 1.68)
  Top 1.422: v157.23,12.19 v157.23,19.81
  Bottom 1.422: 148.08,19.81 R22.2 148.59,19.81 v157.23,19.81 157.73,20.57 IC6.11 | IC6.14 157.73,11.68 v157.23,12.19
  Bottom 1.676: IC6.14 157.73,7.87
N$57
  Bottom 1.676: R23.2 147.57,37.34 148.84,36.07 R16.1 148.84,32.77 R22.1
N$58
  Bottom 1.676: R24.1 144.78,33.53 144.78,38.1 | 144.78,38.1 R25.2 | R15.1 143,39.88 144.78,38.1
N$59
  Bottom 1.676: 157.23,59.69 IC5.12 155.96,58.17 145.29,58.17 R25.1
N$60
  Bottom 1.422: R24.2 146.81,22.35 151.89,22.35 153.16,23.62 IC6.12
N$61
  Bottom 1.422: IC7.9 107.44,59.69 112.52,59.69 | 112.52,59.69 IC7.11 | IC7.13 117.6,59.69 112.52,59.69 | 112.52,59.69 IC7.4
N$62
  Bottom 1.676: 164.85,54.86 IC5.16 164.85,36.58 | 164.85,54.86 IC5.9 | IC5.9 | 164.85,54.86 C25.2 | 164.85,36.58 C23.+ | 164.85,36.58 164.85,32.77 164.85,28.19 | IC6.9 162.81,26.16 164.85,28.19 | 164.85,28.19 165.12,29.21 C26.1 | C21.+ 163.07,64.52 164.85,62.74 IC5.9
  Bottom 1.93: 164.85,32.77 R42.1
N$63
  Bottom 1.676: R20.1 161.04,36.83 162.31,38.1 IC5.15
N$64
  Bottom 1.422: IC6.10 160.27,17.02 145.29,17.02 144.02,15.75 R18.1
N$65
  Bottom 1.422: IC4.7 135.64,30.23 136.4,30.99 141.48,30.99 143.51,28.96 150.37,28.96 151.64,30.23 151.64,38.1 R26.2
N$66
  Bottom 1.422: IC6.15 160.27,14.99 146.56,14.99 R17.1
N$68
  Bottom 1.676: IC7.3 115.06,68.33 R19.2
N$69
  Bottom 1.676: IC8.8 C28.1
N$70  (via drill 0.6 pad 1.68)
  other vias: 192.53,56.39
N$71  (via drill 0.6 pad 1.68)
  Top 1.422: v159.51,55.12 v159.51,49.28
  Bottom 1.422: 159.77,55.88 v159.51,55.12 R23.1 | v159.51,49.28 159.77,48.77 IC5.14
  Bottom 1.676: 159.77,55.88 IC5.11
N$72
  Bottom 1.676: C28.2 R19.1
N$73
  Bottom 1.422: 63.5,62.23 61.98,63.75 61.98,69.34 60.96,70.36 C44.2 | 63.5,62.23 74.68,62.23 75.95,60.96 R27.1 | Q1.2 51.56,68.6 51.56,70.36 | 51.56,70.36 52.07,70.36 53.59,70.36 | 63.5,62.23 C30.1 | R33.1 50.04,70.36 51.56,70.36
  Bottom 1.676: 53.59,70.36 C44.2
N$74  (via drill 0.6, 0.6 pad 1.68)
  Top 1.676: v192.53,25.91 v192.53,56.39
  Bottom 1.676: C41.- 173.1,72.77 X2.3 D3.A 179.83,62.99 183.64,62.99 185.17,61.47 IC5.1 185.17,58.67 185.42,58.42 194.82,58.42 | 194.82,58.42 195.07,58.42 195.33,58.67 | 195.33,58.67 195.83,59.18 C31.- | C39.2 194.82,57.4 195.33,57.91 195.33,58.67 | 183.13,24.64 183.13,26.42 184.66,26.92 178.82,26.92 177.29,28.45 C32.- | 183.13,24.64 IC6.1 183.13,22.35 184.15,22.35 | 183.13,24.64 183.9,24.64 | 184.15,22.35 189.48,22.35 192.53,25.4 v192.53,25.91 | C38.2 184.15,25.15 184.15,22.35 | 194.82,58.42 194.82,58.17 194.31,58.17 v192.53,56.39
N$75
  Bottom 1.676: R27.2 83.57,62.23 85.85,64.52 IC8.3
N$76
  Bottom 1.422: X5.5 198.88,40.64 197.36,42.16 197.36,50.29 194.31,53.34 191.01,53.34 188.72,55.63 177.55,55.63 IC5.4
N$77  (via drill 0.6 pad 1.68)
  Top 1.676: v186.69,11.18 v186.69,36.58 | v188.98,64.77 189.48,64.26 189.48,44.96 v188.98,44.45
  Bottom 1.676: C42.+ 194.69,72.77 X2.1 v188.98,64.77 188.98,65.53 D4.C | IC5.24 187.96,44.2 188.85,43.31 | 188.85,43.31 188.98,43.18 | IC6.24 185.17,8.38 | 185.17,8.38 186.69,9.91 v186.69,11.18 C33.+ | C37.1 185.93,7.87 185.42,8.38 185.17,8.38 | C36.+ v186.69,36.58 189.2,36.58 C40.1 188.98,36.87 188.98,37.59 189.23,37.59 188.98,37.85 v188.98,44.45 188.85,44.45 188.85,43.31
N$78
  Bottom 1.422: IC5.21 177.55,48.01 189.74,48.01 192.28,45.47 192.28,37.85 194.56,35.56 X5.4
N$79
  Bottom 1.422: X5.1 198.12,20.32 192.28,14.48 184.91,14.48 182.37,11.94 175.51,11.94 IC6.21
N$80
  Bottom 1.422: IC6.4 175.51,19.81 191.26,19.81 196.85,25.4 X5.2
N$81
  Bottom 1.676: R28.2 83.82,67.06 IC8.2
N$82
  Bottom 1.93: R35.2 19.05,48.01 21.08,50.04 | 47.5,50.04 C15.+ 48.51,51.05 62.23,51.05 | 62.23,51.05 74.93,51.05 | 74.93,51.05 83.82,51.05 | 83.82,51.05 R38.2 | 74.93,51.05 C34.1 | 47.5,50.04 R36.2 | 21.08,50.04 27.18,50.04 | 27.18,50.04 30.48,50.04 | 30.48,50.04 39.88,50.04 | 39.88,50.04 47.5,50.04 | 62.23,51.05 R37.2 | 105.66,48.77 R41.2 | 30.48,50.04 C22.1 | 105.66,48.77 110.49,48.77 112.01,50.29 117.09,50.29 | 117.09,50.29 116.84,50.04 R40.1 | 117.09,50.29 140.97,50.29 | 140.97,50.29 141.99,50.29 | 141.99,50.29 145.8,50.29 154.18,41.91 154.18,34.8 156.21,32.77 R42.2 | 83.82,51.05 93.73,51.05 | 93.73,51.05 96.01,51.05 98.3,48.77 105.66,48.77 | 93.73,51.05 C35.+ | C12.1 143.76,50.32 141.99,50.29 | 140.97,50.29 140.97,57.4 | 140.97,57.4 X1.1 | 140.97,57.4 R39.1 | 27.18,50.04 D1.C | 21.08,50.04 D2.C | 39.88,50.04 JP1.1
N$83
  Bottom 1.422: Q2.1 72.64,68.6 72.64,76.2 | 48.77,72.9 C46.1 | Q1.1 51.41,66.55 45.97,66.55
  Bottom 1.676: 88.65,69.85 IC8.1 | 88.65,69.85 C29.1 | 88.65,69.85 88.39,69.6 85.09,69.6 83.57,71.12 83.57,73.91 81.28,76.2 72.64,76.2 63.5,76.2 60.45,72.9 48.77,72.9 47.24,72.9 45.97,71.63 45.97,66.55 45.97,64.26 | 45.97,64.26 C47.+ | R44.1 45.97,64.26
N$84
  Bottom 1.676: IC1.19 R29.2
N$85
  Bottom 1.676: IC1.18 R30.2
N$86
  Bottom 1.422: 75.95,70.1 R32.1 C45.1 | 75.95,70.1 C43.2 | 75.95,70.1 75.95,66.8 75.76,66.61 | 75.76,66.61 Q2.2 | R28.1 75.76,66.61
N$87
  Bottom 1.422: 54.36,67.56 Q1.3 | 54.36,67.56 57.4,67.56 | 57.4,67.56 Q3.1 | R34.1 54.36,67.56 | C30.2 58.42,64.01 57.4,65.02 57.4,67.56
N$88
  Bottom 1.422: Q3.2 69.85,67.56 | 69.85,67.56 Q2.3 | 69.85,67.56 69.85,67.06 R43.1 | C43.1 69.85,69.85 69.85,67.56
N$90
  Bottom 1.93: R44.2 40.64,64.26 39.12,62.74 39.12,58.42 38.73,58.04 | 38.73,58.04 38.1,57.4 35.81,57.4 | C48.1 31.75,57.4 | 31.75,57.4 35.81,57.4 | 35.81,57.4 D5.C | JP1.2 39.88,56.9 38.73,58.04 | X4.1 28.7,70.61 31.75,67.56 31.75,57.4
PE  (via drill 1.1)
  other vias: 10.16,74.42
  pour Top (no thermals): 1.78,56.9 13.97,56.9 13.97,77.98 1.78,77.98
  pour Bottom (no thermals): 1.78,56.9 13.97,56.9 13.97,77.98 1.78,77.98
(copper drawn outside any net)
  shapes: Bottom area x148, Bottom circle x163, Top area x6, Top circle x104